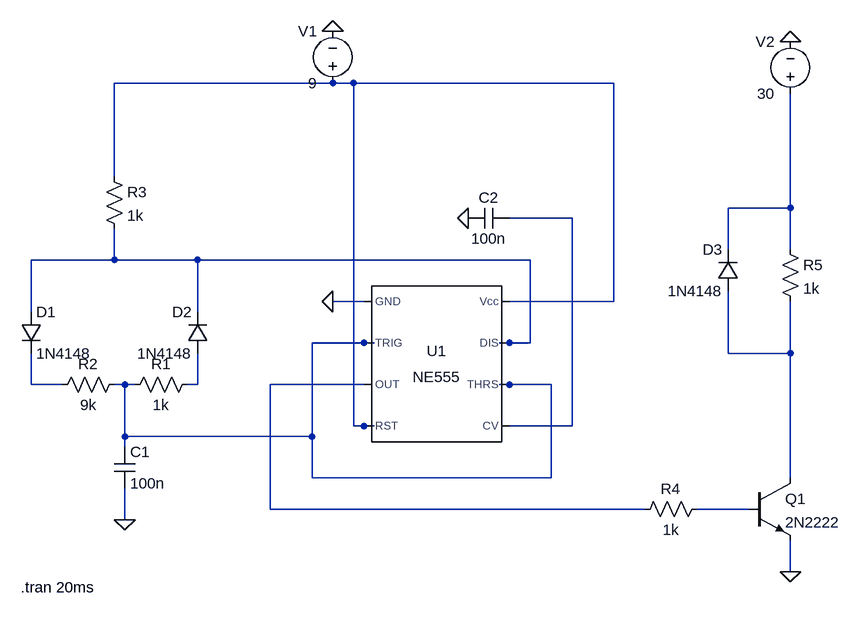
[diagram p0: schematic Robotelier_1_555timer.asc]
Robotelier_1_555timer.asc, the LTspice schematic file:
Version 4.1
SHEET 1 880 680
WIRE 32 -256 -304 -256
WIRE 64 -256 32 -256
WIRE 464 -256 64 -256
WIRE -304 -112 -304 -256
WIRE 736 -64 736 -240
WIRE 736 -64 640 -64
WIRE 400 -48 304 -48
WIRE 640 0 640 -64
WIRE 736 0 736 -64
WIRE -304 16 -304 -32
WIRE -304 16 -432 16
WIRE -176 16 -304 16
WIRE 336 16 -176 16
WIRE 80 80 32 80
WIRE 464 80 464 -256
WIRE 464 80 304 80
WIRE -432 96 -432 16
WIRE -176 96 -176 16
WIRE 80 144 0 144
WIRE 96 144 80 144
WIRE 304 144 288 144
WIRE 336 144 336 16
WIRE 336 144 304 144
WIRE 640 160 640 64
WIRE 736 160 736 80
WIRE 736 160 640 160
WIRE -432 208 -432 160
WIRE -384 208 -432 208
WIRE -288 208 -304 208
WIRE -272 208 -288 208
WIRE -176 208 -176 160
WIRE -176 208 -192 208
WIRE 80 208 -64 208
WIRE 304 208 288 208
WIRE 368 208 304 208
WIRE 64 272 64 -256
WIRE 80 272 64 272
WIRE 96 272 80 272
WIRE 400 272 400 -48
WIRE 400 272 304 272
WIRE -288 288 -288 208
WIRE 0 288 0 144
WIRE 0 288 -288 288
WIRE -288 304 -288 288
WIRE 0 352 0 288
WIRE 368 352 368 208
WIRE 368 352 0 352
WIRE 736 352 736 160
WIRE -64 400 -64 208
WIRE 512 400 -64 400
WIRE 672 400 592 400
WIRE -288 416 -288 368
WIRE 736 496 736 448
FLAG -288 416 0
FLAG 32 -336 0
FLAG 736 496 0
FLAG 736 -320 0
FLAG 240 -48 0
FLAG 32 80 0
SYMBOL Misc\\NE555 192 176 R0
SYMATTR InstName U1
SYMBOL cap -304 304 R0
SYMATTR InstName C1
SYMATTR Value 100n
SYMBOL diode -448 96 R0
SYMATTR InstName D1
SYMATTR Value 1N4148
SYMBOL diode -160 160 R180
WINDOW 0 24 64 Left 2
WINDOW 3 24 0 Left 2
SYMATTR InstName D2
SYMATTR Value 1N4148
SYMBOL res -176 192 R90
WINDOW 0 0 56 VBottom 2
WINDOW 3 32 56 VTop 2
SYMATTR InstName R1
SYMATTR Value 1k
SYMBOL res -288 192 R90
WINDOW 0 0 56 VBottom 2
WINDOW 3 32 56 VTop 2
SYMATTR InstName R2
SYMATTR Value 9k
SYMBOL res -320 -128 R0
SYMATTR InstName R3
SYMATTR Value 1k
SYMBOL voltage 32 -240 R180
WINDOW 0 24 96 Left 2
WINDOW 3 24 16 Left 2
WINDOW 123 0 0 Left 0
WINDOW 39 0 0 Left 0
SYMATTR InstName V1
SYMATTR Value 9
SYMBOL res 608 384 R90
WINDOW 0 0 56 VBottom 2
WINDOW 3 32 56 VTop 2
SYMATTR InstName R4
SYMATTR Value 1k
SYMBOL npn 672 352 R0
SYMATTR InstName Q1
SYMATTR Value 2N2222
SYMBOL voltage 736 -224 R180
WINDOW 0 24 96 Left 2
WINDOW 3 24 16 Left 2
WINDOW 123 0 0 Left 0
WINDOW 39 0 0 Left 0
SYMATTR InstName V2
SYMATTR Value 30
SYMBOL res 720 -16 R0
SYMATTR InstName R5
SYMATTR Value 1k
SYMBOL diode 656 64 R180
WINDOW 0 24 64 Left 2
WINDOW 3 24 0 Left 2
SYMATTR InstName D3
SYMATTR Value 1N4148
SYMBOL cap 304 -64 R90
WINDOW 0 0 32 VBottom 2
WINDOW 3 32 32 VTop 2
SYMATTR InstName C2
SYMATTR Value 100n
TEXT -448 520 Left 2 !.tran 20ms

The netlist it stands for:
* Robotelier_1_555timer.asc
X§U1 0 N005 N009 N001 N003 N005 N004 N001 NE555  ; pins GND TRIG OUT RST CV THRS DIS Vcc
C1 N005 0 100n
D1 N004 N007 1N4148
D2 N008 N004 1N4148
R1 N008 N005 1k
R2 N005 N007 9k
R3 N001 N004 1k
V1 N001 0 9
R4 N010 N009 1k
Q1 N006 N010 0 0 2N2222
V2 N002 0 30
R5 N002 N006 1k
D3 N006 N002 1N4148
C2 N003 0 100n
.model D D
.lib standard.dio
.model NPN NPN
.model PNP PNP
.lib standard.bjt
.tran 20ms
.lib NE555.sub
.backanno
.end